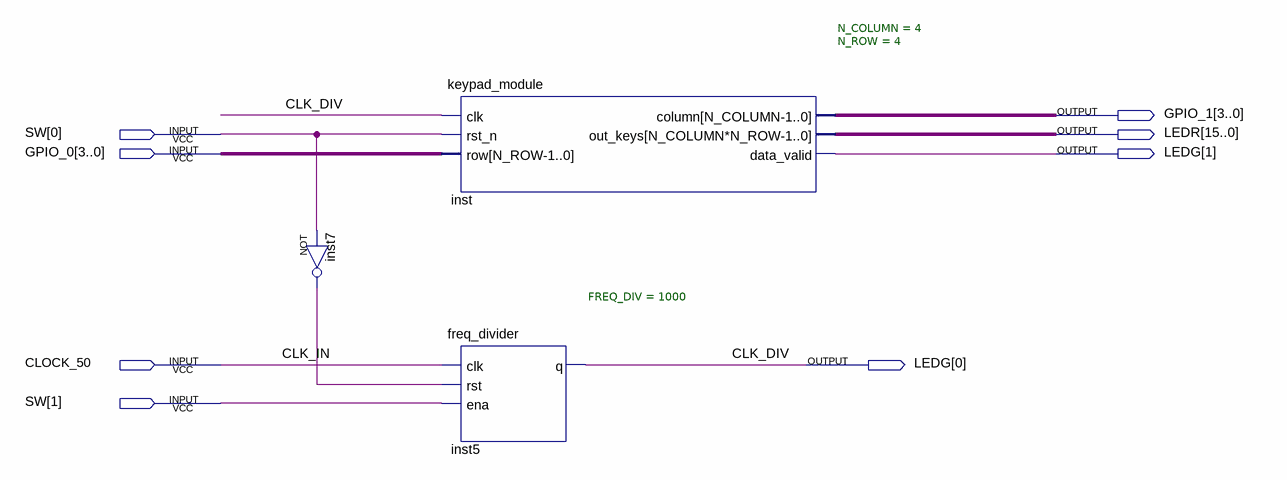
[diagram p0: schematic sheet]
// Quartus schematic keypad.bdf as structural Verilog: 3 symbols, 8 pins
module keypad (
  input  [1:0] SW,
  input  [3:0] GPIO_0,
  input  CLOCK_50,
  output [3:0] GPIO_1,
  output [15:0] LEDR,
  output [1:0] LEDG
);

  wire inst7_out;

  not inst7 (inst7_out, SW[0]);
  keypad_module #(.N_COLUMN(4), .N_ROW(4)) inst (
    .clk(LEDG[0]), .rst_n(SW[0]), .row(GPIO_0), .column(GPIO_1), .out_keys(LEDR), .data_valid(LEDG[1]));
  freq_divider #(.FREQ_DIV(1000)) inst5 (.clk(CLOCK_50), .rst(inst7_out), .ena(SW[1]), .q(LEDG[0]));

  // Other names for the same wires on the sheet: CLK_DIV = LEDG[0]; CLK_IN = CLOCK_50
endmodule
